# EAGLE design PIRSN v2 (EAGLE 9.6.2)
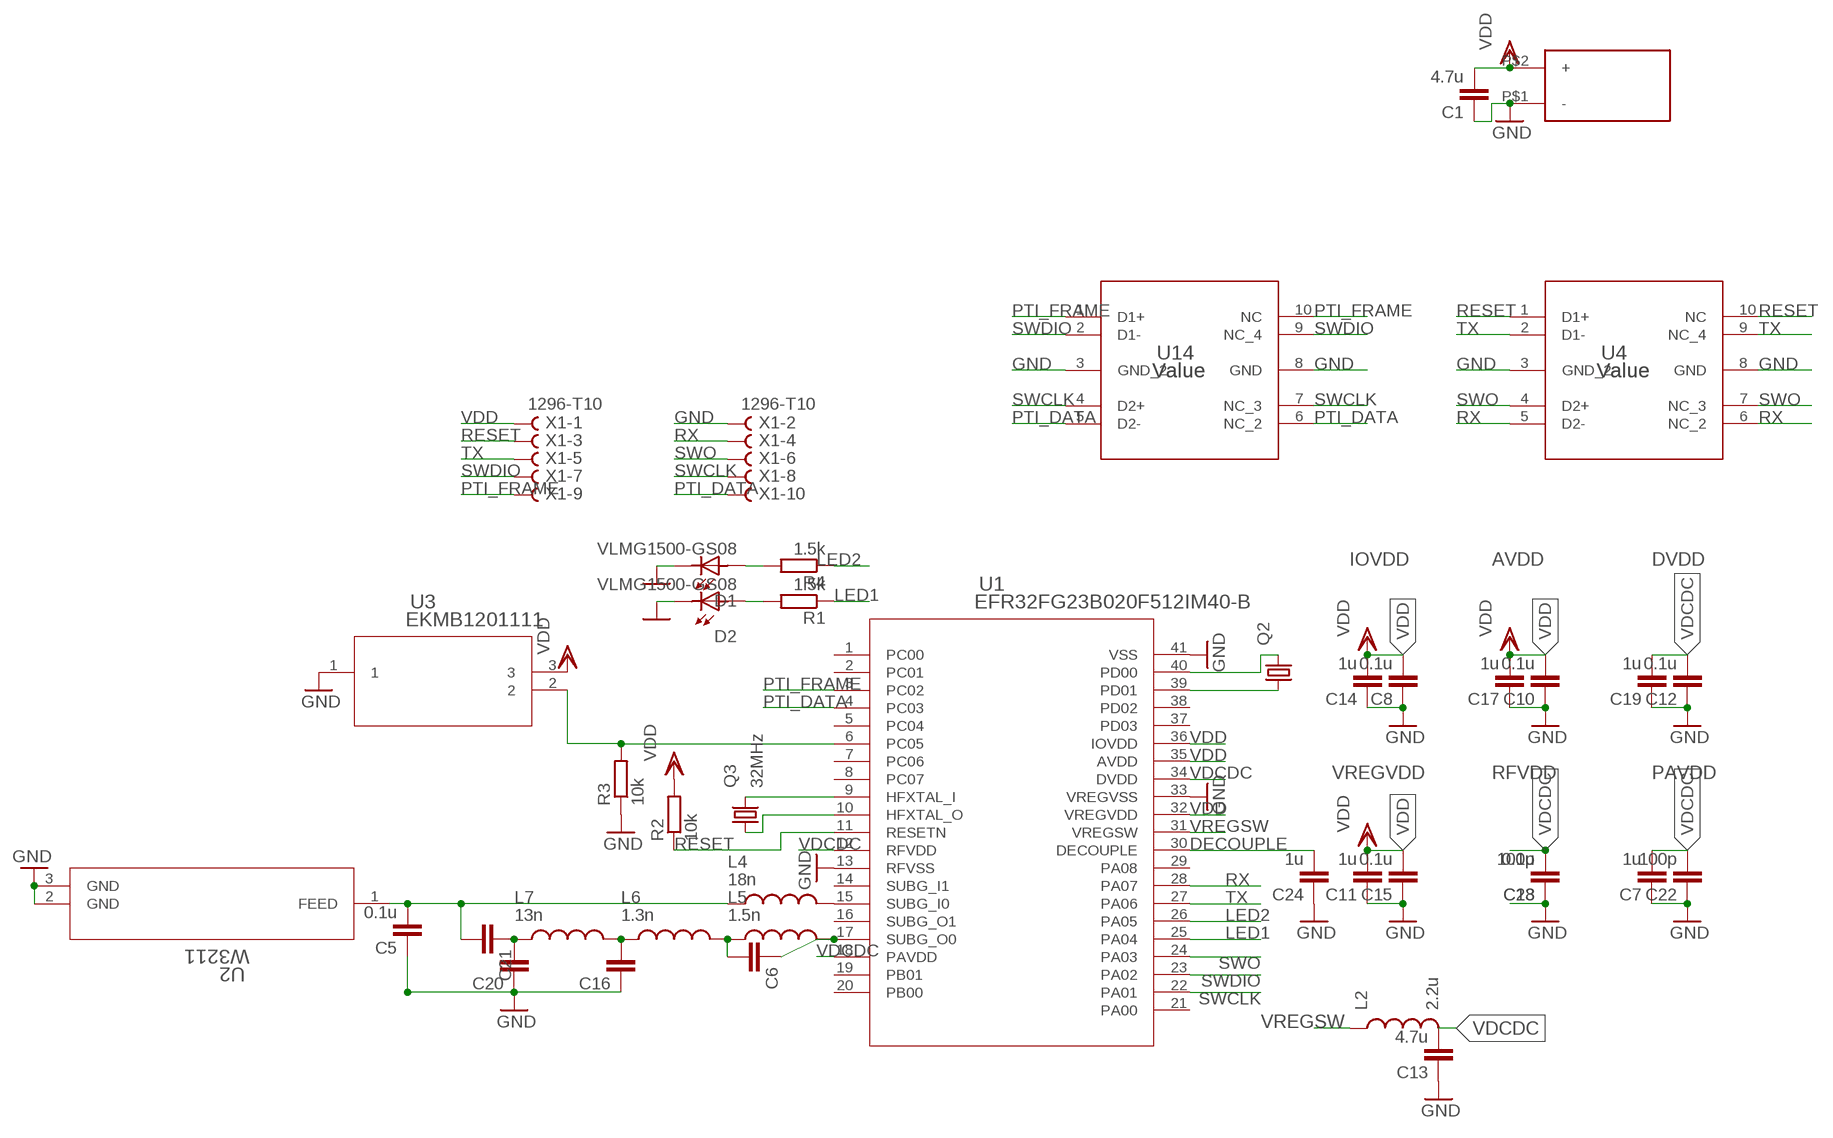
[diagram p0: schematic, sheet 1]

## Parts
C1  4.7u  CC0603R  [C0603R]
C5  0.1u  CC0402  [C0402]
C6  1.9p  CC0402  [C0402]
C7  1u  CC0402  [C0402]
C8  0.1u  CC0402  [C0402]
C10  0.1u  CC0402  [C0402]
C11  1u  CC0402  [C0402]
C12  0.1u  CC0402  [C0402]
C13  4.7u  CC0603R  [C0603R]
C14  1u  CC0402  [C0402]
C15  0.1u  CC0402  [C0402]
C16  7.2p  CC0402  [C0402]
C17  1u  CC0402  [C0402]
C18  0.1u  CC0402  [C0402]
C19  1u  CC0402  [C0402]
C20  1.3p  CC0402  [C0402]
C21  220p  CC0402  [C0402]
C22  100p  CC0402  [C0402]
C23  100p  CC0402  [C0402]
C24  1u  CC0402  [C0402]
D1  VLMG1500-GS08  [LEDC1005X35N]
D2  VLMG1500-GS08  [LEDC1005X35N]
L2  2.2u  INDUCTOR  [L0603]
L4  18n  MHQ0402P7N5JT000  [INDC0402X26N]
L5  1.5n  MHQ0402P7N5JT000  [INDC0402X26N]
L6  1.3n  MHQ0402P7N5JT000  [INDC0402X26N]
L7  13n  MHQ0402P7N5JT000  [INDC0402X26N]
Q2  KX-327-RT  [2.0X1.2]
Q3  32MHz  KX-5  [2.0X1.6_KX-5]
R1  1.5k  RR0402  [R0402]
R2  10k  RR0402  [R0402]
R3  10k  RR0402  [R0402]
R4  1.5k  RR0402  [R0402]
U1  EFR32FG23B020F512IM40-B  [QFN_40_SIL]
U2  W3211  [CHIP_3211_PUL]
U3  EKMB1201111  [SENSOR_B1201111_PAN]
U4  Value  ESD204DQAR  [DQA0010A]
U14  Value  ESD204DQAR  [DQA0010A]
U$2  BS-24R  [BS-24]
X1  1296-T10  [1296-10]

## Nets
DECOUPLE: C24.2 U1.30(DECOUPLE)
GND: C1.1 C5.1 C7.1 C8.1 C10.1 C11.1 C12.1 C13.1 C14.1 C15.1 C16.1 C17.1 C18.1 C19.1 C20.1 C22.1 C23.1 C24.1 D1.2 D2.2 R3.1 U1.13(RFVSS) U1.33(VREGVSS) U1.41(VSS) U2.2(GND) U2.3(GND) U3.1 U4.3(GND_2) U4.8(GND) U14.3(GND_2) U14.8(GND) U$2.P$1(-) X1.2
LED1: R1.1 U1.25(PA04)
LED2: R4.1 U1.26(PA05)
N$1: D2.1 R1.2
N$4: R3.2 U1.6(PC05) U3.2
N$5: C5.2 C21.2 L4.1 U2.1(FEED)
N$6: C6.1 L5.2 U1.17(SUBG_O0)
N$7: D1.1 R4.2
N$16: Q3.3 U1.9(HFXTAL_I)
N$17: Q3.1 U1.10(HFXTAL_O)
N$18: Q2.1 U1.39(PD01)
N$19: Q2.2 U1.40(PD00)
N$20: L4.2 U1.15(SUBG_I0)
N$22: C6.2 L5.1 L6.2
N$23: C16.2 L6.1 L7.2
N$24: C20.2 C21.1 L7.1
PTI_DATA: U1.4(PC03) U14.5(D2-) U14.6(NC_2) X1.10
PTI_FRAME: U1.3(PC02) U14.1(D1+) U14.10(NC) X1.9
RESET: R2.1 U1.11(RESETN) U4.1(D1+) U4.10(NC) X1.3
RX: U1.28(PA07) U4.5(D2-) U4.6(NC_2) X1.4
SWCLK: U1.22(PA01) U14.4(D2+) U14.7(NC_3) X1.8
SWDIO: U1.23(PA02) U14.2(D1-) U14.9(NC_4) X1.7
SWO: U1.24(PA03) U4.4(D2+) U4.7(NC_3) X1.6
TX: U1.27(PA06) U4.2(D1-) U4.9(NC_4) X1.5
VDCDC: C7.2 C12.2 C13.2 C18.2 C19.2 C22.2 C23.2 L2.2 U1.12(RFVDD) U1.18(PAVDD) U1.34(DVDD)
VDD: C1.2 C8.2 C10.2 C11.2 C14.2 C15.2 C17.2 R2.2 U1.32(VREGVDD) U1.35(AVDD) U1.36(IOVDD) U3.3 U$2.P$2(+) X1.1
VREGSW: L2.1 U1.31(VREGSW)
Unconnected: U1.1(PC00) U1.2(PC01) U1.5(PC04) U1.7(PC06) U1.8(PC07) U1.14(SUBG_I1) U1.16(SUBG_O1) U1.19(PB01) U1.20(PB00) U1.21(PA00) U1.29(PA08) U1.37(PD03) U1.38(PD02)

## Notes on the sheet
- IOVDD | AVDD | DVDD
- VREGVDD | RFVDD | PAVDD

## Library data of the parts
C1 C13 = eagle-ltspice:C: CAPACITOR, European symbol
C5-C8 C10-C12 C14-C24 = eagle-ltspice:C: CAPACITOR, European symbol; SPICEMODEL: NONE; SPICEPREFIX: C
D1 D2 = VLMG1500-GS08:VLMG1500-GS08: 0402 GREEN 571nm 35MCD 65° Rectangle with Flat Top SMT LED; AVAILABILITY: Unavailable; DESCRIPTION: 0402 GREEN 571nm 35MCD 65° Rectangle with Flat Top SMT LED; MF: Vishay; MP: VLMG1500-GS08; PACKAGE: 0402 Vishay; PRICE: None
L2 = BeagleBone_Blue_R3:INDUCTOR: Inductors Basic Inductor/Choke - 0603 and 1206. Footprints are not proven and vary greatly between part numbers. SRN6045- 33uH, 20% 1.4A
L4-L7 = MHQ0402P7N5JT000:MHQ0402P7N5JT000: 221 NH 5% GOLD TERMINAL; AVAILABILITY: Unavailable; DESCRIPTION: FIXED IND 7.5NH 200MA 1.2 OHM; MF: TDK; MP: MHQ0402P7N5JT000; PACKAGE: 0402 TDK; PRICE: None
Q2 = crystal-geyer_V1_0:KX-327: Tuning Fork Crystals (kHz) SMD: KX327 - Serie Model Size l/w/h [mm] Frequency Range Frequency Stability Temp. Range [°C] Load Capacitance AECQ 200 availabel Datasheet KX-327VT KX-327FT KX-327RT KX-327NHT KX-327NHF KX-327L KX-327S 1.25/1.05/0.5 1.6/1.0/0.5 2.0/1.2/0.6 3.2/1.5/0.8 3.2/1.5/0.8 7.0/1.5/1.4 8.2/3.8/2.5 32,768 kHz 32,768 kHz 32,768 kHz 32,768 kHz 32,768 kHz 32,768 kHz 32,768 kHz ±10 … ±20ppm ±10 … ±20ppm ±10 … ±20ppm ±10 … ±20ppm ±10 … ±20ppm ±10 … ±20ppm ±5 … ±20ppm (*) -40°C …+85°C (*) -40°C …+85°C (*) -40°C …+85°C (*) -40°C …+85°C (*) -40°C …+125°C (*) -40°C …+85°C (*) -40°C …+85°C 7/9/12,5 7/9/12,5 7/9/12,6 7/9/12,5 9/12,5 7/9/12,5 6/12,5 - - - - yes - - KX-327VT.pdf <http://www.geyer-electronic.de/uploads/tx_userartikelfrequenz/GEYER-KX-327VT.pdf> KX-327FT.pdf <http://www.geyer-electronic.de/uploads/tx_userartikelfrequenz/GEYER-KX-327FT.pdf> KX-327RT.pdf <http://www.geyer-electronic.de/uploads/tx_userartikelfrequenz/GEYER-KX-327RT.pdf> KX-327NHT.pdf <http://www.geyer-electronic.de/uploads/tx_userartikelfrequenz/GEYER-KX-327NHT.pdf> KX-327NHF.pdf <http://www.geyer-electronic.de/uploads/tx_userartikelfrequenz/GEYER-KX-327NHF.pdf> KX-327L.pdf <http://www.geyer-electronic.de/uploads/tx_userartikelfrequenz/GEYER-KX-327L.pdf> KX-327S.pdf <http://www.geyer-electronic.de/uploads/tx_userartikelfrequenz/GEYER-KX-327S.pdf> <http://www.geyer-electronic.de/fileadmin/template/img/logo-geyer-electronic.png> Details see: http://www.geyer-electronic.de/Frequenz-Produkte.9.0.html Created 2016-06-07, Hans Locher 2016 (C) Geyer Quartz Technology KX327VT,KX327FT,KX327RT,KX327NHT,KX327NHF,KX327S,KX327L;125105;1610;2012;3215;7015;8238;1,25x1,05,1.25x1.05;1,6x1,0,1.6x1.0;2,0x1,2,2.0x1.2;3,2x1,5,3.2x1.5;8,2x3,8,8.2x3.8,7.0x1.5,7,0x1,532.768kHz
Q3 = crystal-geyer_V1_0:KX: Quartz Crystals (MHz) SMD: KX - Serie Model Size l/w/h [mm] Frequency Range Frequency Stability Temp. Range [°C] Load Capacitance AECQ 200 availabel Datasheet KX-4 KX-5 KX-6 KX-7 KX-9A KX-9B KX-12A KX-12B KX-13 KX-20 KX-K KX-KS 1.6/1.2/0.3 2.0/1.6/0.45 2.5/2.0/0.55 3.2/2.5/0.8 5.0/3.2/1.0 5.0/3.2/1.1 6.0/3.5/1.1 6.0/3.5/1.0 7.0/5.0 /1.3 11.6/5.5/1.6 12.3/4.5/4.2 12.3/4.5/3.2 24.0 ~ 80.0 MHz 16.0 ~ 80.0 MHz 12.0 ~ 80.0 MHz 8.0 ~ 60.0 MHz 7,68 ~ 300,0 MHz 8,0 ~ 50,0 MHz 8,0 ~ 150,0 MHz 8,0 ~ 50,0 MHz 6,0 ~ 160,0 MHz 3,579 ~ 25,0 MHz 3,579 ~ 70,0 MHz 3,579 ~ 70,0 MHz ±10 … ±50ppm ±10 … ±50ppm ±10 … ±50ppm ±10 … ±50ppm ±10 … ±50ppm ±10 … ±50ppm ±10 … ±50ppm ±10 … ±50ppm ±10 … ±50ppm ±50ppm ±10 … ±50ppm ±10 … ±50ppm (*) -40°C …+85°C (*) -40°C …+125°C (*) -40°C …+125°C (*) -40°C …+125°C (*) -40°C …+105°C (*) -40°C …+105°C (*) -40°C …+125°C (*) -40°C …+105°C (*) -40°C …+105°C (*) -40°C …+105°C (*) -40°C …+85°C (*) -40°C …+85°C 8, 8…16 8, 8…16 10, 8…16 12, 7…20 16, 10…20 16, 10…20 16, 10…20 16, 12…20 16, 12…20 16, 12…20 16, 12…30 16, 12…30 - yes yes yes - - - - - - - - KX-4.pdf <http://www.geyer-electronic.de/uploads/tx_userartikelfrequenz/GEYER-KX-4.pdf> KX-5.pdf <http://www.geyer-electronic.de/uploads/tx_userartikelfrequenz/GEYER-KX-5.pdf> KX-6.pdf <http://www.geyer-electronic.de/uploads/tx_userartikelfrequenz/GEYER-KX-6.pdf> KX-7.pdf <http://www.geyer-electronic.de/uploads/tx_userartikelfrequenz/GEYER-KX-7.pdf> KX-9A.pdf <http://www.geyer-electronic.de/uploads/tx_userartikelfrequenz/GEYER-KX-9A.pdf> KX-9B.pdf <http://www.geyer-electronic.de/uploads/tx_userartikelfrequenz/GEYER-KX-9B.pdf> KX-12A.pdf <http://www.geyer-electronic.de/uploads/tx_userartikelfrequenz/GEYER-KX-12A.pdf> KX-12B.pdf <http://www.geyer-electronic.de/uploads/tx_userartikelfrequenz/GEYER-KX-12B.pdf> KX-13.pdf <http://www.geyer-electronic.de/uploads/tx_userartikelfrequenz/GEYER-KX-13.pdf> KX-20.pdf <http://www.geyer-electronic.de/uploads/tx_userartikelfrequenz/GEYER-KX-20.pdf> KX-K.pdf <http://www.geyer-electronic.de/uploads/tx_userartikelfrequenz/GEYER-KX-K.pdf> KX-KS.pdf <http://www.geyer-electronic.de/uploads/tx_userartikelfrequenz/GEYER-KX-KS.pdf> <http://www.geyer-electronic.de/fileadmin/template/img/logo-geyer-electronic.png> Details see: http://www.geyer-electronic.de/Frequenz-Produkte.9.0.html Created 2016-06-07, Hans Locher 2016 (C) Geyer Quartz Technology KX4,KX5,KX6,KX7,KX9A,KX9B,KX12A,KX12B,KX13,KX20,KXK,KXKS;1612;2016;2520;3225;5032;6035;7050;11655;12345;1,6x1,2;2,0x1,6;2,5x2,0;3,2x2,5;5,0x3,2;6,0x3,5;7,0x5,0;11,6x5,5;12,3x4,5;12,3x4,5;1.6x1.2;2.0x1.6;2.5x2.0;3.2x2.5;5.0x3.2;6.0x3.5;7.0x5.0;11.6x5.5;12.3x4.5;12.3x4.5;
R1-R4 = eagle-ltspice:R: RESISTOR, European symbol; SPICEMODEL: NONE; SPICEPREFIX: R
U1 = EFR32FG23B020F512IM40-B:EFR32FG23B020F512IM40-B; COPYRIGHT: Copyright (C) 2022 Ultra Librarian. All rights reserved.; MANUFACTURER_PART_NUMBER: EFR32FG23B020F512IM40-B; MFR_NAME: Silicon Labs
U2 = W3211:W3211; COPYRIGHT: Copyright (C) 2022 Ultra Librarian. All rights reserved.; MANUFACTURER_PART_NUMBER: W3211; MFR_NAME: Pulse Electronics Corporation
U3 = EKMB1110112:EKMB1201111; COPYRIGHT: Copyright (C) 2022 Ultra Librarian. All rights reserved.; MANUFACTURER_PART_NUMBER: EKMB1201111; MFR_NAME: Panasonic
U4 U14 = ESD204DQAR:ESD204DQAR; MANUFACTURER: Texas Instruments; PARTNUMBER: ESD204DQAR; REFDES: RefDes; TYPE: TYPE
U$2 = BS-24:BS-24R
X1 = con-leotronics:1296-T10: 1.27mm SINGLE ROW FEMALE SOCKET Source: http://www.leotronics.co.uk/Conexcon/Data%20Sheets/sec.%20A/1296ing.pdf; OC_FARNELL: unknown; OC_NEWARK: unknown

## Board
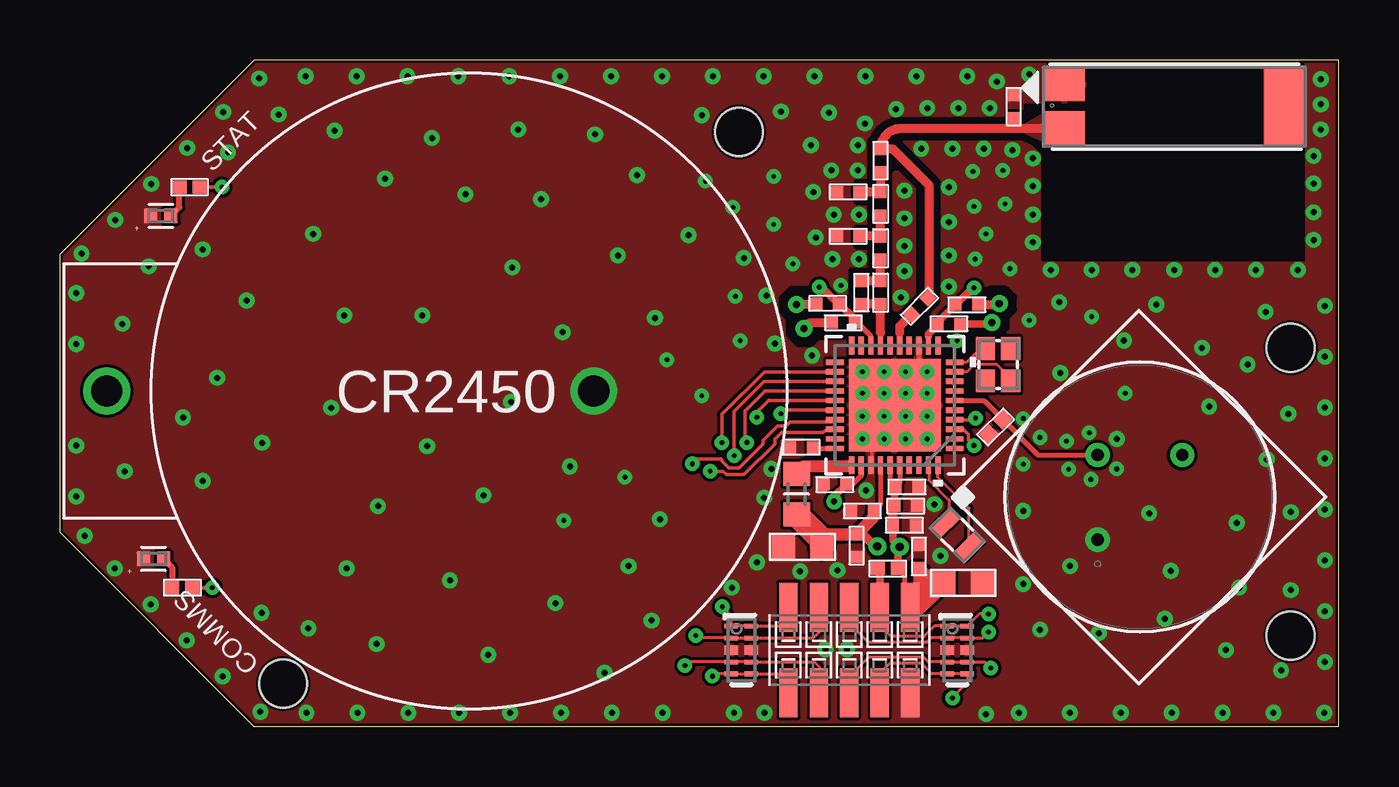
[diagram p1: board, top side]
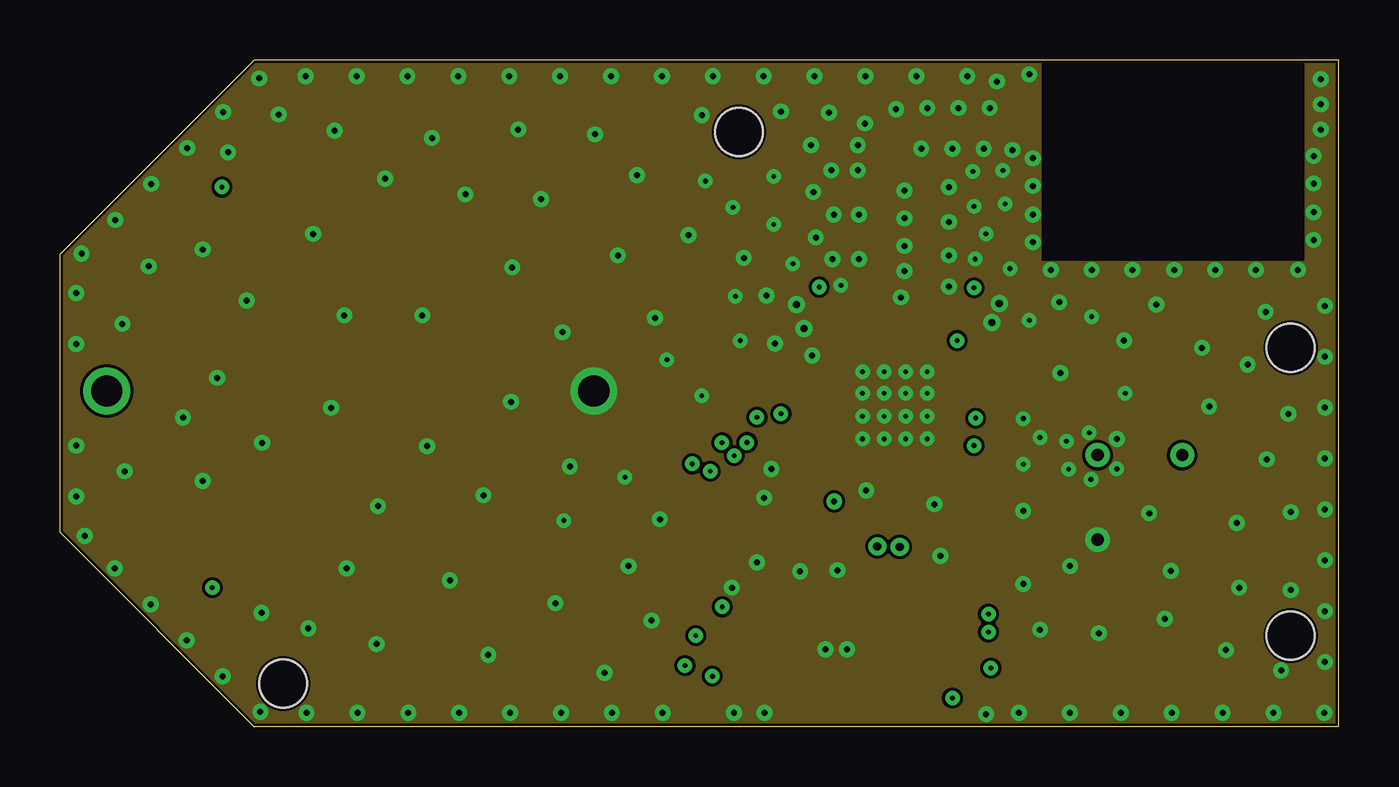
[diagram p2: board, inner layer Route2]
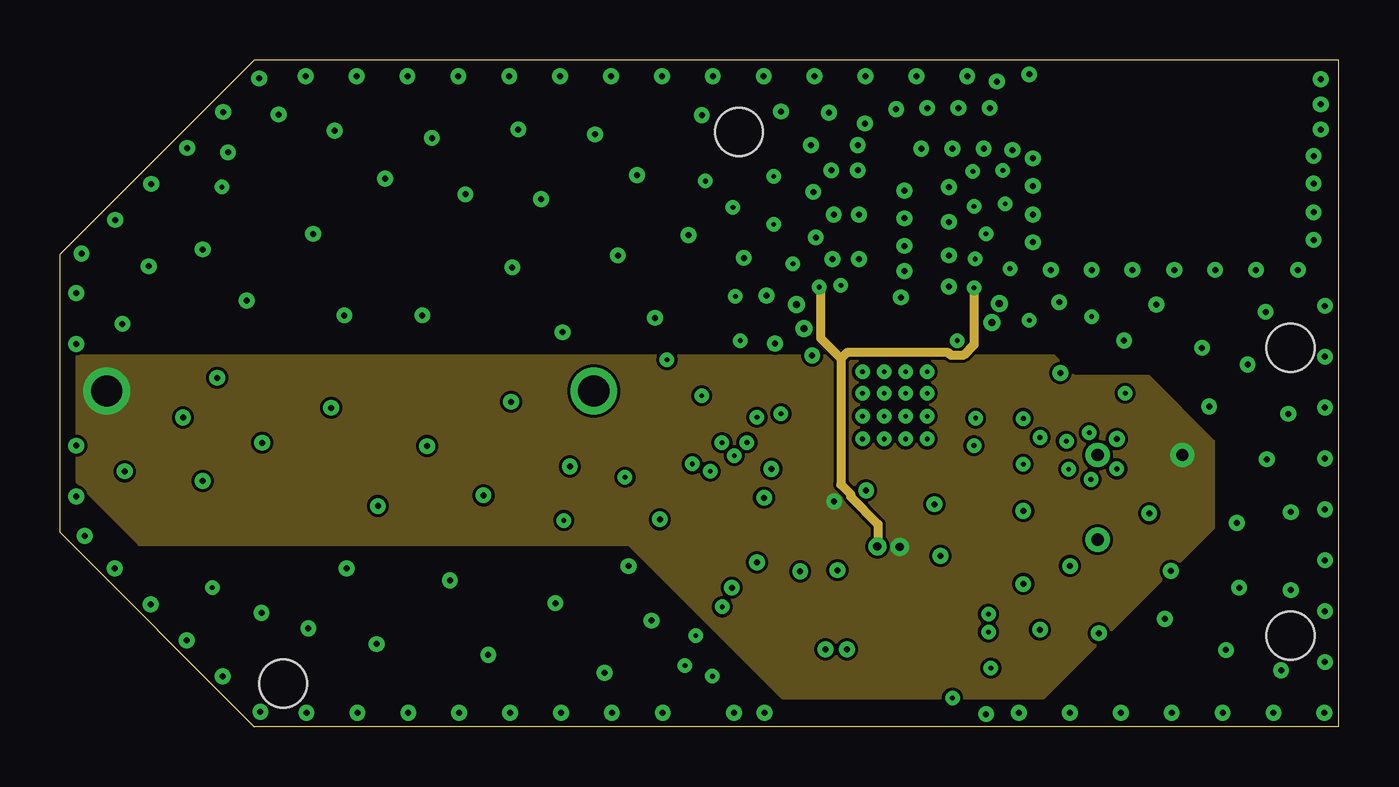
[diagram p3: board, inner layer Route15]
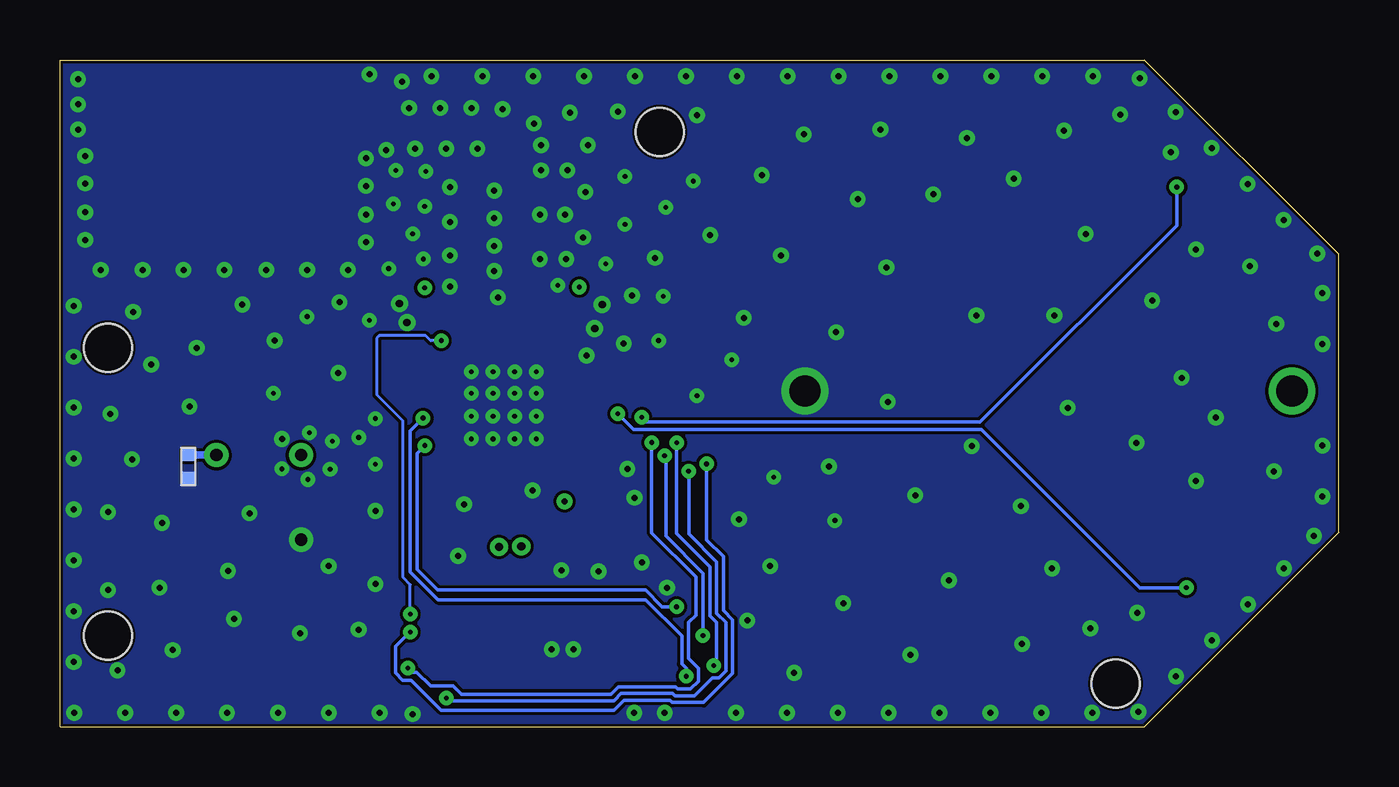
[diagram p4: board, bottom side, seen from below]

Size 53.3 x 27.8 mm. Coordinates in mm from the lower left corner, seen from the top.
Outline: 53.3,0 53.3,27.8 8.1,27.8 0,19.7 0,8.1 8.1,0 53.3,0
Copper layers (1+2*15+16): Top 0.035mm / dielectric 0.51mm / Route2 0.035mm / dielectric 0.15mm / Route15 0.035mm / dielectric 0.2mm / Bottom 0.035mm
Design rules "default *": minimum track width 5mil, minimum drill 0.2mm, track to track 5mil, track to pad 5mil, pad to pad 5mil, via to via 5mil, smd to smd 5mil, copper to edge 5mil, drill to drill 6mil, minimum pad ring 10mil, minimum via ring 8mil, stop-mask expansion 0mil, vias tented up to drill 40mil, thermal gap 0mil
Holes 2 mm at 9.3,1.8 51.3,3.8 51.3,15.8 28.3,24.8
tRestrict: area 30.2,16 to 32.6,18.2; area 36.9,16.6 to 39.7,18.2; 43 lines

### Footprints (pad centres in the part's own frame; a part is rotated, then mirrored left to right if it is on the bottom)
C0603R = smd 0.95 x 0.95: 1 -0.85,0; 2 0.75,0
C0402 = smd 0.5 x 0.5: 1 -0.475,0; 2 0.475,0
LEDC1005X35N = smd 0.59 x 0.61: 1 -0.415,0; 2 0.415,0
L0603 = smd 1 x 1.1: 1 -0.85,0; 2 0.85,0
INDC0402X26N = smd 0.5 x 0.5: 1 -0.732,0; 2 0.232,0
2.0X1.2 = smd 0.6 x 1.1: 1 -0.7,0; 2 0.7,0
2.0X1.6_KX-5 = smd 0.95 x 0.8: 1 -0.675,-0.525; 2 0.675,-0.525; 3 0.675,0.525; 4 -0.675,0.525
R0402 = smd 0.6 x 0.55: 1 -0.425,0; 2 0.425,0
QFN_40_SIL = smd 0.74 x 0.22: 1 -2.495,1.8; 2 -2.495,1.4; 3 -2.495,1; 4 -2.495,0.6; 5 -2.495,0.2; 6 -2.495,-0.2; 7 -2.495,-0.6; 8 -2.495,-1; 9 -2.495,-1.4; 10 -2.495,-1.8; 21 2.495,-1.8; 22 2.495,-1.4; 23 2.495,-1; 24 2.495,-0.6; 25 2.495,-0.2; 26 2.495,0.2; 27 2.495,0.6; 28 2.495,1; 29 2.495,1.4; 30 2.495,1.8 | smd 0.22 x 0.74: 11 -1.8,-2.495; 12 -1.4,-2.495; 13 -1,-2.495; 14 -0.6,-2.495; 15 -0.2,-2.495; 16 0.2,-2.495; 17 0.6,-2.495; 18 1,-2.495; 19 1.4,-2.495; 20 1.8,-2.495; 31 1.8,2.495; 32 1.4,2.495; 33 1,2.495; 34 0.6,2.495; 35 0.2,2.495; 36 -0.2,2.495; 37 -0.6,2.495; 38 -1,2.495; 39 -1.4,2.495; 40 -1.8,2.495 | smd 3.85 x 3.85: 41 0,0
CHIP_3211_PUL = smd 1.7 x 1.45: 1 -4.277,-0.9; 3 -4.277,0.95 | smd 1.7 x 3.2: 2 4.877,0
SENSOR_B1201111_PAN = drill 0.508 pad 1.016: 1 0,0; 2 0,3.531; 3 3.531,3.531
DQA0010A = smd 0.565 x 0.2: 1 -0.417,1; 2 -0.417,0.5; 4 -0.417,-0.5; 5 -0.417,-1; 6 0.417,-1; 7 0.417,-0.5; 9 0.417,0.5; 10 0.417,1 | smd 0.565 x 0.4: 3 -0.417,0; 8 0.417,0
BS-24 = drill 1.3: P$1 0,0; P$2 20.3,0
1296-10 = smd 0.76 x 2.05: 1 -2.54,-1.78; 2 -2.54,1.78; 3 -1.27,-1.78; 4 -1.27,1.78; 5 0,-1.78; 6 0,1.78; 7 1.27,-1.78; 8 1.27,1.78; 9 2.54,-1.78; 10 2.54,1.78

### Placement (x,y rotation side)
C1  37.6,6 180 top
C5  39.75,25.85 270 top
C6  33.4,18.1 90 top
C7  33.2,7.55 90 top
C8  35.8,7.1 270 top
C10  35.2,8.4 180 top
C11  32.3,10.1 0 top
C12  37.8,17.6 180 top
C13  31,7.5 0 top
C14  47.95,10.85 90 bottom
C15  35.3,10 180 top
C16  32.85,20.45 0 top
C17  35.25,9.2 180 top
C18  32,17.65 0 top
C19  33.45,9 0 top
C20  32.85,22.3 0 top
C21  34.2,23.6 90 top
C22  32.65,16.85 0 top
C23  37.05,16.8 180 top
C24  30.9,11.65 0 top
D1  3.9,7 180 top
D2  4.2,21.3 180 top
L2  30.7,9.7 270 top
L4  35.65,17.35 225 top
L5  34.2,17.85 270 top
L6  34.2,19.7 270 top
L7  34.2,21.55 270 top
Q2  37.4,8 315 top
Q3  39.1,15.1 270 top
R1  5.4,22.5 180 top
R2  34.5,6.6 0 top
R3  39,12.5 45 top
R4  5.1,5.8 180 top
U1  34.8,13.4 180 top
U2  46.15,25.85 0 top
U3  43.25,7.8 0 top
U4  37.4,3.2 0 top
U14  28.4,3.2 0 top
U$2  22.25,14 180 top
X1  32.9,3.2 180 top

### Tracks (layer width: path | path; a pad name or v marks a point on that pad's centre or on a via)
DECOUPLE
  Top 0.203: C24.2 31.43,11.6 U1.30
GND  (via drill 0.2, 0.25, 0.3)
  Top 0.15: 35.8,15.5 35.85,15.45 35.85,14.85 34.8,13.8 U1.41 34.8,13.45 v36.15,14.8 | U1.13 35.8,15.7 | 33.85,12.35 33.85,10.96 U1.33
  Top 0.2: 35.8,15.7 35.8,15.5 35.8,15.05 35.85,15
  Top 0.305: C23.1 38.79,16.8 v38.84,16.85
  Top 0.368: 31.53,17.5 C18.1 31.48,17.6 v30.7,17.6 | 38.27,17.55 C12.1 39.15,17.6 v39.15,17.65 | 32.11,16.78 C22.1 31.26,16.85 v31.01,16.6
  other vias: 40.55,23.7 35.2,20.05 35.2,19 35.05,17.9 33.6,9.85 40.4,27.2 37.05,18.35 31.5,20.4 31.4,22.3 35.2,21.2 35.2,22.35 52.25,21.45 52.25,22.65 52.25,23.8 52.25,20.3 51.6,19.05 49.85,19.05 48.15,19.05 46.45,19.05 44.7,19.05 43,19.05 41.3,19.05 40.55,20.2 40.55,21.35 40.55,22.55 52.55,24.9 52.55,25.95 52.55,27 44.05,10.75 42.9,12.26 40.85,12.06 42.97,10.31 42.04,10.74 40.15,10.95 44.4,13.9 41.95,11.9 43,17.1 38.15,19.5 39.3,23.2 39.4,21.8 38.05,23.15 38.1,21.7 38.6,20.55 32.55,18.4 50.9,2.35 51.3,5.7 49.15,5.8 48.6,3.2 40.85,4.05 43.3,3.9 46.05,4.5 46.3,6.5 49.05,8.5 51.3,8.95 50.3,11.15 51.2,13.05 44.05,12 47.9,13.35 45.4,8.9 40.15,9 42.1,6.7 37.05,22.5 37.05,21.05 37.05,19.65 24.8,17.05 41.65,17.7 41.7,14.75 44.35,16.1 45.7,17.6 32.25,21.35 33.3,21.35 49.5,15.1 50.25,17.3 13.25,9.2 35.9,24.1 33.25,24.25 32.15,23.2 34.85,25.75 33.55,25.15 33.25,23.2 32.05,25.6 31.3,24.25 30.05,25.65 26.75,25.5 36.15,25.8 32.2,19.5 23.25,19.65 33.3,19.5 24.05,23 22.3,24.7 20.05,22 19.1,24.9 18.85,19.15 15.5,24.55 16.9,22.2 13.55,22.85 11.45,24.85 7,23.95 10.55,20.55 11.85,17.15 15.1,17.15 5.95,19.9 3.7,19.2 2.6,16.8 6.55,14.55 2.7,10.65 5.95,10.25 8.4,4.75 10.35,4.1 25,8.65 11.95,6.6 13.2,3.45 15.3,11.7 11.3,13.3 16.25,6.1 29.05,6.85 17.85,3 20.65,5.15 23.7,6.7 22.7,2.25 29.65,10.75 29.35,9.55 21.25,10.85 18.8,13.55 20.95,16.45 47.6,15.8 52.73,2.7 52.73,4.82 52.73,6.94 52.73,9.06 52.73,11.18 52.73,13.31 52.73,15.43 52.73,17.55 7.78,17.77 8.43,11.84 0.68,9.6 0.68,11.72 5.13,12.89 0.68,15.96 0.68,18.08 9.11,25.53 37.82,27.13 35.7,27.13 33.57,27.13 31.45,27.13 29.33,27.13 27.21,27.13 25.09,27.13 22.97,27.13 20.85,27.13 18.73,27.13 16.6,27.13 14.48,27.13 12.36,27.13 10.24,27.13 8.3,27.03 6.8,25.63 5.3,24.13 0.9,19.73 3.8,22.63 2.3,21.13 1.03,7.95 2.28,6.6 6.78,2.1 3.78,5.1 5.28,3.6 52.7,0.58 50.58,0.58 48.46,0.58 46.34,0.58 44.22,0.58 42.09,0.58 39.97,0.58 38.6,0.53 29.37,0.58 28.1,0.58 25.12,0.58 23,0.58 20.88,0.58 18.76,0.58 16.64,0.58 14.52,0.58 12.4,0.58 10.28,0.58 8.35,0.63 28,5.8 24.65,4.43 17.65,9.65 38.75,25.8 37.45,25.8 39.05,26.9 37.2,24.1 38.5,24.1 39.7,24.05 28.5,19.55 23.55,10.4 21,8.6 39.6,19.1 28.15,17.95 40.4,16.95 40.15,12.85 29.75,20.95 29.75,22.95 28.05,21.65 26.9,22.75 30.55,19.3 26.2,20.5 26.75,13.8 25.3,15.3 28.35,16.1 40.15,5.95 36.15,12.95 35.25,12.95 34.35,12.95 33.45,12.95 33.45,13.9 34.35,13.9 35.25,13.9 36.15,13.9 35.25,14.8 34.35,14.8 33.45,14.8 34.35,12 33.45,12 35.25,12 36.15,12 31.9,3.23 32.8,3.23 32.4,6.53 30.85,6.48 36.7,7.13 36.45,9.28 31.35,15.48 29.8,15.98 29.45,17.98
  pour Top: 0,19.7 8.1,27.8 41.05,27.8 41.05,27.35 42.7,27.35 42.7,26.05 40.1,26.05 40.1,24.6 40.85,23.85 40.85,19.35 51.95,19.35 51.95,24.2 50.25,24.2 50.25,27.3 51.95,27.3 51.95,27.8 53.3,27.8 53.3,0 8.1,0 0,8.1
  pour Bottom: 0.05,19.7 8.2,27.85 53.4,27.85 53.4,-0.1 8.1,-0.1 0,8 0,19.65
  pour Route2: -0.05,19.65 8.05,27.75 40.85,27.75 40.85,19.35 51.95,19.35 51.95,27.8 53.3,27.8 53.3,0 8.05,0 0,8.05 0,19.6
LED1  (via drill 0.2)
  Top 0.152: R1.1 v6.75,22.5 | U1.25 29.53,13.6 29.05,13.12 v29.05,12.91
  Bottom 0.152: v6.75,22.5 6.75,20.9 14.95,12.7 28.84,12.7 v29.05,12.91
LED2  (via drill 0.2)
  Top 0.152: R4.1 v6.35,5.8 | v30.05,13.05 30.2,13.2 U1.26
  Bottom 0.152: v6.35,5.8 8.3,5.8 14.9,12.4 29.4,12.4 v30.05,13.05
N$1
  Top 0.254: D2.1 4.97,21.66 R1.2
N$4
  Top 0.2: U1.6 38.5,13.6 R3.2 40.77,11.33 U3.2
N$5
  Top 0.15: C5.2 39.75,24.95
  Top 0.203: C21.2 arc90 34.23,24.05 34.75,24.05 34.8,24
  Top 0.368: U2.1 39.75,24.95 35.07,24.95 arc90 C21.2 34.73,24.07 34.75,24.05 | L4.1 36.22,17.92 36.22,22.58 34.8,24
  pour Top (rank 2): 40.11,24.82 41.15,24.36 41.15,25.65 40.15,25.06
N$6
  Top 0.2: U1.17 34.2,16.15
  Top 0.203: U1.17 34.2,16.41
  Top 0.368: C6.1 33.41,17.62 L5.2 34.2,16.41
N$7
  Top 0.254: D1.1 4.67,6.64 R4.2
N$16
  Top 0.127: Q3.3 39.62,14.52 39.04,15.1 38.1,15.1 37.8,14.8 U1.9
N$17
  Top 0.127: U1.10 37.79,15.2 38.37,15.78 Q3.1
N$18
  Top 0.127: Q2.1 37.05,8.64 37.05,9.45 36.22,10.29 36.22,10.89 U1.39
N$19
  Top 0.127: Q2.2 37.89,9.11 36.6,10.4 U1.40
N$20
  Top 0.2: 35,16.3 U1.15
  Top 0.203: U1.15 35,16.41
  Top 0.368: L4.2 35,16.7 35,16.41
N$22
  Top 0.2: 34.2,19.4 L6.2
  Top 0.368: 34.2,19.4 L5.1 C6.2
N$23
  Top 0.2: L6.1 34.2,20.45 | 34.2,20.45 L7.2 | 33.9,20.45 34.2,20.45
  Top 0.368: C16.2 33.9,20.45 34.18,20.45 L6.1 L7.2
N$24
  Top 0.368: C21.1 L7.1 33.34,22.28 C20.2
PTI_DATA  (via drill 0.2)
  Top 0.127: X1.10 30.45,1.51 30.45,2.05 30.3,2.2 U14.6 U14.5 27.29,2.2 v27.19,2.11
  Top 0.152: U1.4 38.1,12.8 v38.17,12.87
  Bottom 0.152: v38.17,12.87 38.7,12.33 38.7,6.45 37.55,5.3 28.9,5.3 27.38,3.78 27.38,2.61 27.19,2.43 v27.19,2.11
PTI_FRAME  (via drill 0.2)
  Top 0.127: X1.9 30.36,4.26 30.3,4.2 U14.10 U14.1 27.98,4.62 v27.6,5
  Top 0.152: v38.09,11.72 37.87,11.95 37.87,12.19 37.66,12.4 U1.3
  Bottom 0.152: v27.6,5 28.2,5 28.9,5.7 37.55,5.7 38.42,6.57 38.42,11.4 v38.09,11.72
RESET  (via drill 0.2)
  Top 0.127: X1.3 34.17,4.23 34.63,3.76 36.02,3.76 36.45,4.2 U4.1 U4.10 38.32,4.7 v38.7,4.7 | U1.11 37.2,15.9 v37.4,16.1
  Top 0.305: X1.3 34.17,6.5 R2.1
  Bottom 0.127: v37.4,16.1 37.85,16.1 38.06,16.31 39.99,16.31 40.1,16.2 40.1,13.85 39.02,12.77 39.02,6.24 38.7,5.92 v38.7,4.7
RX  (via drill 0.2)
  Top 0.127: X1.4 34,1.59 34,2.05 34.59,2.64 35.9,2.64 36.33,2.2 U4.5 U4.6 37.82,1.85 37.2,1.23 v37.2,1.2
  Top 0.152: U1.28 31.94,12.4 31.8,12.26 30.06,12.26 29.8,12 29.8,11.8 28.51,10.51 27.77,10.51 27.64,10.65 v27.1,10.65
  Bottom 0.152: v27.1,10.65 27.08,10.63 27.08,8.03 25.93,6.88 25.93,4.73 25.54,4.35 25.54,2.34 25.84,2.04 26.11,2.04 26.86,1.3 27.67,1.3 27.76,1.39 29.91,1.39 30.22,1.08 37.08,1.08 v37.2,1.2
SWCLK  (via drill 0.2)
  Top 0.127: X1.8 31.65,1.44 31.65,2.5 31.45,2.7 U14.7 U14.4 26.2,2.7 v26.05,2.55
  Top 0.152: U1.22 29.36,14.8 27.59,13.04 v27.59,11.84
  Bottom 0.152: v26.05,2.55 25.94,2.66 25.94,4.35 26.21,4.62 26.21,6.66 27.61,8.06 27.61,10.86 27.59,10.87 v27.59,11.84
SWDIO  (via drill 0.2)
  Top 0.127: X1.7 31.63,3.93 31.4,3.7 U14.9 U14.2 26.6,3.7 v26.5,3.8
  Top 0.152: v28.1,11.3 28.1,13.15 29.35,14.4 U1.23
  Bottom 0.152: v26.5,3.8 26.49,3.81 26.49,6.39 28.05,7.95 28.05,11.25 v28.1,11.3
SWO  (via drill 0.2)
  Top 0.127: X1.6 32.9,2.1 33.69,2.89 36,2.89 36.19,2.7 U4.4 U4.7 38.55,2.7 v38.8,2.45
  Top 0.152: U1.24 29.39,14 28.54,13.16 28.54,11.94 v28.63,11.85
  Bottom 0.152: v28.63,11.85 28.63,8.08 26.8,6.25 26.8,4.65 27.1,4.35 27.1,2.85 26.69,2.44 26.69,1.9 27.01,1.57 27.55,1.57 27.64,1.67 30.02,1.67 30.33,1.36 36.56,1.36 36.91,1.71 37.86,1.71 38.43,2.27 38.62,2.27 v38.8,2.45
TX  (via drill 0.2)
  Top 0.127: X1.5 32.9,4.3 33.69,3.51 36.12,3.51 36.31,3.7 U4.2 U4.9 38.45,3.7 v38.7,3.95
  Top 0.152: U1.27 32.22,12.71 30.43,12.71 30.26,12.54 29.9,12.54 29.3,11.94 29.3,11.78 28.31,10.79 27.89,10.79 27.59,11.09 27.59,11.11 27.54,11.16 26.55,11.16 v26.35,10.96
  Bottom 0.152: v26.35,10.96 26.35,7.8 25.65,7.1 25.65,4.85 25.26,4.46 25.26,2.22 26.47,1.02 27.78,1.02 27.88,1.11 29.79,1.11 30.21,0.69 37.41,0.69 38.66,1.94 39.01,1.94 39.31,2.24 39.31,3.34 v38.7,3.95
VDCDC  (via drill 0.2, 0.35)
  Top 0.2: U1.34 34.2,9.28 C19.2 | 36.2,16.3 U1.12 | 37.29,17.56 C12.2 37.44,17.71
  Top 0.203: U1.18 33.8,16.3 33.25,16.85 C22.2
  Top 0.305: v31.65,18.33 31.8,18.18 31.89,18.18 32.42,17.65 C18.2 33.12,17 C22.2 | v38.1,18.3 37.93,18.13 37.85,18.13 37.44,17.71 | 37.29,17.56 36.57,16.85 C23.2 36.57,16.75 36.2,16.37 36.2,16.3 | C13.2 31.75,7.41
  Top 0.368: C7.2 33.46,8.03 33.97,7.52 v34.07,7.52
  Top 0.508: C13.2 32.27,8.03 C7.2 | C7.2 31.53,8.03 L2.2 | C7.2 33.92,8.75 C19.2
  Top 1.016: L2.2 31.75,7.8 C13.2
  Route15 0.368: v34.07,7.52 34.1,7.55 34.1,8.45 32.96,9.59 32.96,9.69 32.55,10.1 32.55,15.35 | v31.65,18.33 31.7,18.28 31.7,16.2 32.55,15.35 | 32.55,15.35 32.8,15.6 37.03,15.6 37.15,15.49 37.65,15.49 38.1,15.93 v38.1,18.3
VDD  (via drill 0.25, 0.35)
  Top 0.2: U1.32 33.4,10.48 33.02,10.1 C11.2 | U1.36 35,10.18 C15.2 34.82,9.25 C17.2 34.77,8.45 C10.2
  Top 0.203: U1.35 34.6,10.12 34.77,9.95 | R2.2 35.2,6.33 35.2,5.22 X1.1
  Top 0.305: C17.2 34.77,9.95 C15.2 | C10.2 34.73,7.77 v35,7.5 34.92,7.42 R2.2 | C11.2 32.27,9.6 v32.27,9.39
  Top 0.368: C10.2 34.73,9.15 34.82,9.25
  Top 0.508: 35.8,5.85 C8.2 36.42,6 C1.2 | 35.8,5.85 35.8,5.08 35.7,4.98 | 36.52,5.67 36.35,5.85 35.8,5.85
  Top 0.61: C1.2 36.52,5.67 35.83,4.98 35.7,4.98 X1.1
  Bottom 0.305: U3.3 C14.2
  pour Route15: 30.1,1.2 41,1.2 48.1,8.3 48.1,11.9 45.4,14.6 42.3,14.6 41.45,15.45 0.7,15.45 0.7,10.2 3.3,7.6 23.7,7.6
VREGSW
  Top 0.2: 32.85,10.86 32.9,10.91
  Top 0.203: 32.9,10.91 U1.31
  Top 0.508: L2.1 31,10.86 32.85,10.86

### Text on the board
tPlace: STAT | CR2450 | COMMS
tStop: PIRSN | v2.0